# EAGLE design lol (EAGLE 5.10)
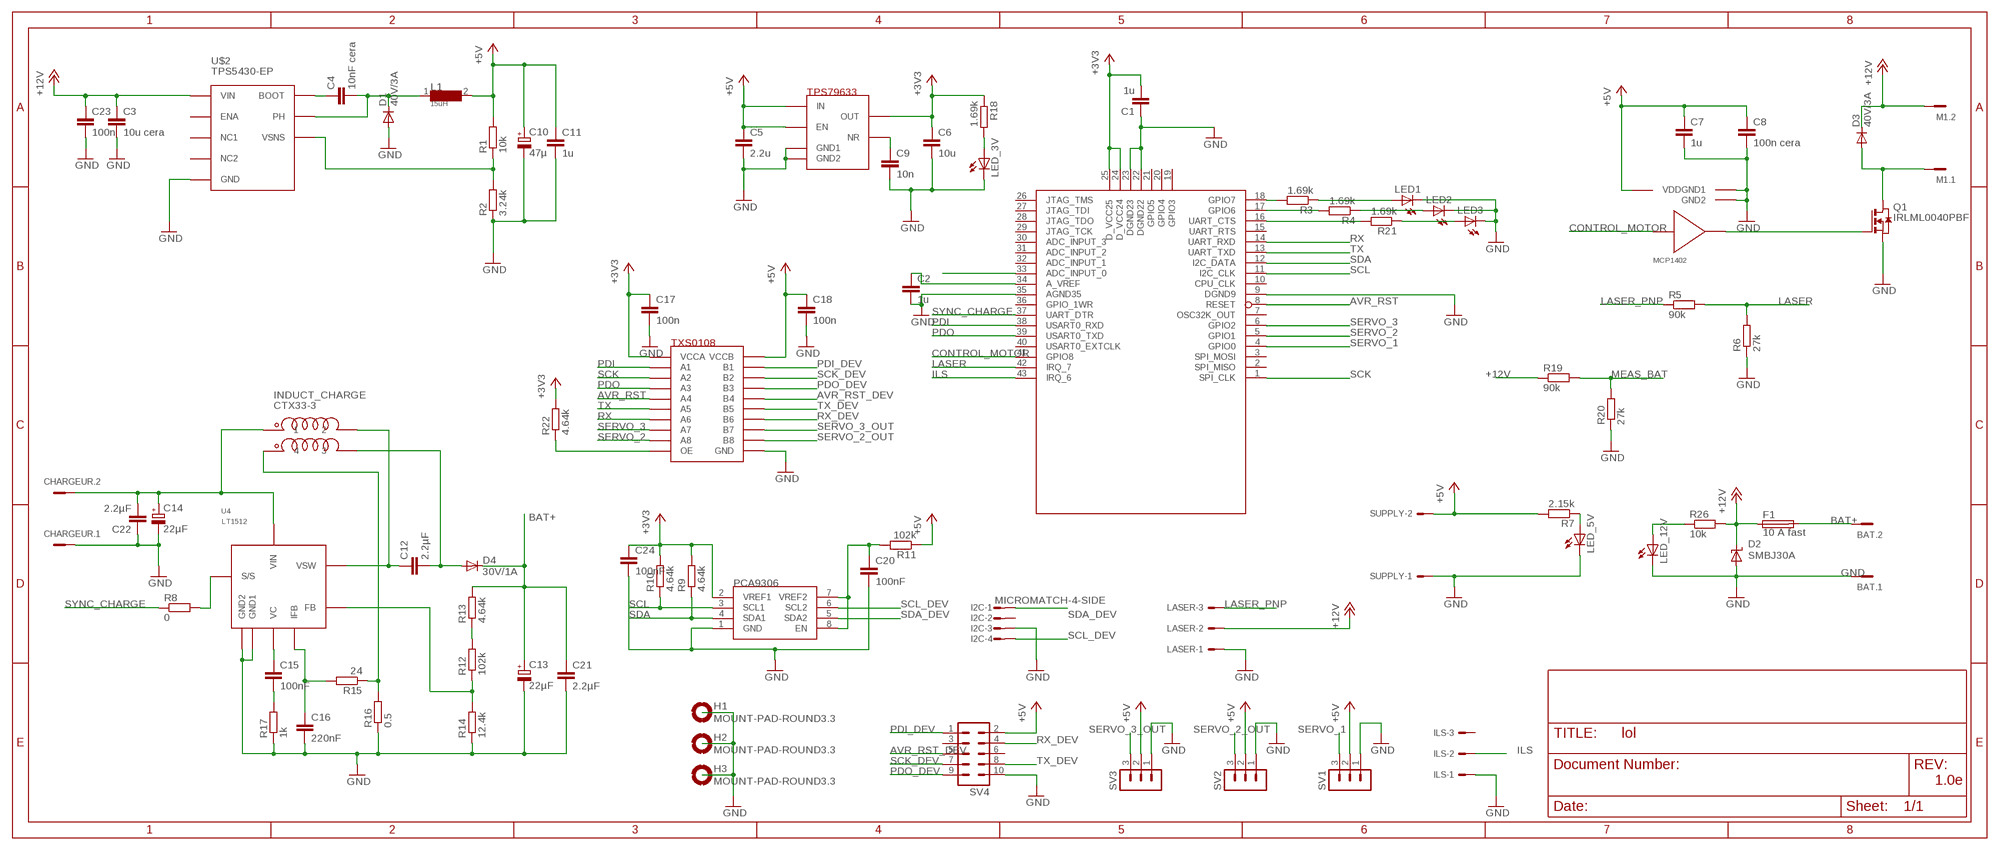
[diagram p0: schematic, sheet 1]

## Parts
BAT  MC2  [MC2]
C1  1u  C-EUC0805  [C0805]
C2  1u  C-EUC0805  [C0805]
C3  10u cera  C-EUC1210  [C1210]
C4  10nF cera  C-EUC0603  [C0603]
C5  2.2u  C-EUC0805  [C0805]
C6  10u  C-EUC1210  [C1210]
C7  1u  C-EUC0603  [C0603]
C8  100n cera  C-EUC0603  [C0603]
C9  10n  C-EUC0603  [C0603]
C10  47µ  CPOL-EUC  [PANASONIC_C]
C11  1u  C-EUC0603  [C0603]
C12  2.2µF  C-EUC0805  [C0805]
C13  22µF  CPOL-EUD/7343-31R  [D/7343-31R]
C14  22µF  CPOL-EUD/7343-31R  [D/7343-31R]
C15  100nF  C-EUC0603  [C0603]
C16  220nF  C-EUC0603  [C0603]
C17  100n  C-EUC0603  [C0603]
C18  100n  C-EUC0603  [C0603]
C20  100nF  C-EUC0805  [C0805]
C21  2.2µF  C-EUC0805  [C0805]
C22  2.2µF  C-EUC0805  [C0805]
C23  100n  C-EUC1206  [C1206]
C24  100nF  C-EUC0805  [C0805]
CHARGEUR  MC2  [MC2]
D1  40V/3A  DIODE-SMB  [SMB]
D2  SMBJ30A  SUPPRESSOR-SMBJ  [SMBJ]
D3  40V/3A  DIODE-SMB  [SMB]
D4  30V/1A  DIODE-SMB  [SMB]
F1  10 A fast  FUSE0448  [0448]
H1  MOUNT-PAD-ROUND3.3  [3,3-PAD]
H2  MOUNT-PAD-ROUND3.3  [3,3-PAD]
H3  MOUNT-PAD-ROUND3.3  [3,3-PAD]
I2C  MICROMATCH-4-SIDE  [MICROMATCH-4-SIDE]
ILS  ED1X03  [ED1X03]
INDUCT_CHARGE  CTX33-3  [CTX33-3]
L1  15uH  INDUCTANCE1  [INDUCTANCE]
LASER  ED1X03  [ED1X03]
LED1  LEDSMT1206  [1206]
LED2  LEDSMT1206  [1206]
LED3  LEDSMT1206  [1206]
LED_3V  LEDSMT1206  [1206]
LED_5V  LEDSMT1206  [1206]
LED_12V  LEDSMT1206  [1206]
M1  MC2  [MC2]
Q1  IRLML0040PBF  [SOT23]
R1  10k  R-EU_R0603  [R0603]
R2  3.24k  R-EU_R0603  [R0603]
R3  1.69k  R-EU_R0603  [R0603]
R4  1.69k  R-EU_R0603  [R0603]
R5  90k  R-EU_R0603  [R0603]
R6  27k  R-EU_M0805  [M0805]
R7  2.15k  R-EU_R0603  [R0603]
R8  0  R-EU_R0603  [R0603]
R9  4.64k  R-EU_R0603  [R0603]
R10  4.64k  R-EU_R0603  [R0603]
R11  102k  R-EU_R0603  [R0603]
R12  102k  R-EU_R0603  [R0603]
R13  4.64k  R-EU_R0603  [R0603]
R14  12.4k  R-EU_R0603  [R0603]
R15  24  R-EU_R0603  [R0603]
R16  0.5  R-EU_R0603  [R0603]
R17  1k  R-EU_R0603  [R0603]
R18  1.69k  R-EU_R0603  [R0603]
R19  90k  R-EU_R0603  [R0603]
R20  27k  R-EU_M0805  [M0805]
R21  1.69k  R-EU_R0603  [R0603]
R22  4.64k  R-EU_R0603  [R0603]
R26  10k  R-EU_R0603  [R0603]
SUPPLY  EC1X02  [EC1X02]
SV1  MA03-1  [MA03-1]
SV2  MA03-1  [MA03-1]
SV3  MA03-1  [MA03-1]
SV4  ML10  [ML10]
U2  TPS79633  [SOT223-5]
U3  TXS0108  [TSSOP20]
U4  LT1512  [LT1512]
U5  ATZB-24-A2  [ATZB-24-A2R]
U6  MCP1402  [SOT23-5]
U$1  PCA9306  [SSOP08]
U$2  TPS5430-EP  [TPS5430-EP]

## Nets
12V_NESTOR: C14.+ C22.2 CHARGEUR.2 INDUCT_CHARGE.P$1 U4.P$5(VIN)
+3V3: C1.2 C6.1 C17.1 C24.1 R9.2 R10.2 R18.1 R22.2 U2.4(OUT) U3.2(VCCA) U5.24(D_VCC24) U5.25(D_VCC25) U$1.2(VREF1)
+5V: C5.1 C7.1 C8.1 C10.+ C11.1 C18.1 L1.2 R1.2 R7.2 R11.1 SUPPLY.2 SV1.2 SV2.2 SV3.2 SV4.2 U2.1(EN) U2.2(IN) U3.19(VCCB) U6.2(VDD)
+12V: C3.1 C23.1 D2.C D3.C F1.P$1 LASER.2 M1.2 R19.1 R26.2 U$2.P$7(VIN)
AVR_RST: U3.5(A4) U5.8(RESET)
AVR_RST_DEV: SV4.5 U3.16(B4)
BAT+: BAT.2 C13.+ C21.1 D4.C F1.P$2 R13.2
CONTROL_MOTOR: U5.41(GPIO8) U6.3(IN)
GND [supply]: BAT.1 C1.1 C2.2 C3.2 C5.2 C6.2 C7.2 C8.2 C9.2 C10.- C11.2 C13.- C14.- C16.2 C17.2 C18.2 C20.2 C21.2 C22.1 C23.2 C24.2 CHARGEUR.1 D1.A D2.A H1.B3,3(MOUNT) H2.B3,3(MOUNT) H3.B3,3(MOUNT) I2C.3 ILS.1 LASER.1 LED1.C LED2.C LED3.C LED_3V.C LED_5V.C LED_12V.C Q1.2(S) R2.1 R6.1 R14.1 R16.1 R17.1 R20.1 SUPPLY.1 SV1.1 SV2.1 SV3.1 SV4.10 U2.3(GND1) U2.6(GND2) U3.11(GND) U4.P$6(GND2) U4.P$7(GND1) U5.9(DGND9) U5.22(DGND22) U5.23(DGND23) U5.35(AGND35) U6.1(GND1) U6.4(GND2) U$1.1(GND) U$2.P$6(GND)
ILS: ILS.2 U5.43(IRQ_6)
LASER: R5.2 R6.2 U5.42(IRQ_7)
LASER_PNP: LASER.3 R5.1
MEAS_BAT: R19.2 R20.2 U5.33(ADC_INPUT_0)
N$1: C9.1 U2.5(NR)
N$2: R3.2 U5.18(GPIO7)
N$3: C4.1 U$2.P$1(BOOT)
N$4: C4.2 D1.C L1.1 U$2.P$8(PH)
N$5: R1.1 R2.2 U$2.P$4(VSNS)
N$6: LED1.A R3.1
N$7: D3.A M1.1 Q1.3(D)
N$8: Q1.1(G) U6.5(OUT)
N$9: LED2.A R4.1
N$10: R4.2 U5.17(GPIO6)
N$11: R12.2 R13.1
N$12: C12.1 INDUCT_CHARGE.P$2 U4.P$8(VSW)
N$13: C15.2 R17.2
N$14: C12.2 D4.A INDUCT_CHARGE.P$3
N$15: INDUCT_CHARGE.P$4 R15.1 R16.2
N$16: R8.2 U4.P$4(S/S)
N$17: C20.1 R11.2 U$1.7(VREF2) U$1.8(EN)
N$18: C15.1 U4.P$1(VC)
N$20: LED_3V.A R18.2
N$21: C2.1 U5.34(A_VREF)
N$22: C16.1 R15.2 U4.P$3(IFB)
N$23: R21.2 U5.16(UART_CTS)
N$24: LED3.A R21.1
N$25: R22.1 U3.10(OE)
N$26: R12.1 R14.2 U4.P$2(FB)
NHLED: LED_12V.A R26.1
NPWLED: LED_5V.A R7.1
PDI: U3.1(A1) U5.38(USART0_RXD)
PDI_DEV: SV4.1 U3.20(B1)
PDO: U3.4(A3) U5.39(USART0_TXD)
PDO_DEV: SV4.9 U3.17(B3)
RX: U3.7(A6) U5.14(UART_RXD)
RX_DEV: SV4.4 U3.14(B6)
SCK: U3.3(A2) U5.1(SPI_CLK)
SCK_DEV: SV4.7 U3.18(B2)
SCL: R10.1 U5.11(I2C_CLK) U$1.3(SCL1)
SCL_DEV: I2C.4 U$1.6(SCL2)
SDA: R9.1 U5.12(I2C_DATA) U$1.4(SDA1)
SDA_DEV: I2C.1 U$1.5(SDA2)
SERVO_1: SV1.3 U5.4(GPIO0)
SERVO_2: U3.9(A8) U5.5(GPIO1)
SERVO_2_OUT: SV2.3 U3.12(B8)
SERVO_3: U3.8(A7) U5.6(GPIO2)
SERVO_3_OUT: SV3.3 U3.13(B7)
SYNC_CHARGE: R8.1 U5.37(UART_DTR)
TX: U3.6(A5) U5.13(UART_TXD)
TX_DEV: SV4.8 U3.15(B5)
Unconnected: I2C.2 ILS.3 SV4.3 SV4.6 U5.2(SPI_MISO) U5.3(SPI_MOSI) U5.7(OSC32K_OUT) U5.10(CPU_CLK) U5.15(UART_RTS) U5.19(GPIO3) U5.20(GPIO4) U5.21(GPIO5) U5.26(JTAG_TMS) U5.27(JTAG_TDI) U5.28(JTAG_TDO) U5.29(JTAG_TCK) U5.30(ADC_INPUT_3) U5.31(ADC_INPUT_2) U5.32(ADC_INPUT_1) U5.36(GPIO_1WR) U5.40(USART0_EXTCLK) U$2.P$2(NC1) U$2.P$3(NC2) U$2.P$5(ENA)

## Notes on the sheet
- IRLML0040PBF
- 1.0e

## Library data of the parts
BAT CHARGEUR M1 = con-phoenix-381_l:MC2: Mini-Combicon 3.81mm horizontal 2-polig MC 1,5/2-G-3,81 Artikel-Nr. 1803277
C1-C9 C11 C12 C15-C18 C20-C24 = rcl:C-EU: CAPACITOR, European symbol
C10 C13 C14 = rcl:CPOL-EU: POLARIZED CAPACITOR, European symbol
D1 D3 D4 = diode:DIODE-: DIODE
D2 = diode:SUPPRESSOR-: Suppressor diode
F1 = apbteam_fuse:FUSE: FUSE
H1-H3 = holes:MOUNT-PAD-ROUND: MOUNTING PAD, round
I2C = apbteam_con-amp-micromatch:MICROMATCH-4: MicroMaTch 4
ILS LASER = apbteam_con-amp-he14:E?1X03: Male header simple row, 3 positions
INDUCT_CHARGE = apbTeam:CTX33-3
L1 = zigbit:INDUCTANCE1: 12x12 mm
LED1-LED3 LED_3V LED_5V LED_12V = led:LED: LED OSRAM: - CHIPLED LG R971, LG N971, LY N971, LG Q971, LY Q971, LO R971, LY R971 LH N974, LH R974 LS Q976, LO Q976, LY Q976 LO Q996 - Hyper CHIPLED LW Q18S LB Q993, LB Q99A, LB R99A - SideLED LS A670, LO A670, LY A670, LG A670, LP A670 LB A673, LV A673, LT A673, LW A673 LH A674 LY A675 LS A676, LA A676, LO A676, LY A676, LW A676 LS A679, LY A679, LG A679 - Hyper Micro SIDELED® LS Y876, LA Y876, LO Y876, LY Y876 LT Y87S - SmartLED LW L88C, LW L88S LB L89C, LB L89S, LG L890 LS L89K, LO L89K, LY L89K LS L896, LA L896, LO L896, LY L896 - TOPLED LS T670, LO T670, LY T670, LG T670, LP T670 LSG T670, LSP T670, LSY T670, LOP T670, LYG T670 LG T671, LOG T671, LSG T671 LB T673, LV T673, LT T673, LW T673 LH T674 LS T676, LA T676, LO T676, LY T676, LB T676, LH T676, LSB T676, LW T676 LB T67C, LV T67C, LT T67C, LS T67K, LO T67K, LY T67K, LW E67C LS E67B, LA E67B, LO E67B, LY E67B, LB E67C, LV E67C, LT E67C LW T67C LS T679, LY T679, LG T679 LS T770, LO T770, LY T770, LG T770, LP T770 LB T773, LV T773, LT T773, LW T773 LH T774 LS E675, LA E675, LY E675, LS T675 LS T776, LA T776, LO T776, LY T776, LB T776 LHGB T686 LT T68C, LB T68C - Hyper Mini TOPLED® LB M676 - Mini TOPLED Santana® LG M470 LS M47K, LO M47K, LY M47K Source: http://www.osram.convergy.de - LUMILED® LXK2-PW12-R00, LXK2-PW12-S00, LXK2-PW14-U00, LXK2-PW14-V00 LXK2-PM12-R00, LXK2-PM12-S00, LXK2-PM14-U00 LXK2-PE12-Q00, LXK2-PE12-R00, LXK2-PE12-S00, LXK2-PE14-T00, LXK2-PE14-U00 LXK2-PB12-K00, LXK2-PB12-L00, LXK2-PB12-M00, LXK2-PB14-N00, LXK2-PB14-P00, LXK2-PB14-Q00 LXK2-PR12-L00, LXK2-PR12-M00, LXK2-PR14-Q00, LXK2-PR14-R00 LXK2-PD12-Q00, LXK2-PD12-R00, LXK2-PD12-S00 LXK2-PH12-R00, LXK2-PH12-S00 LXK2-PL12-P00, LXK2-PL12-Q00, LXK2-PL12-R00 Source: www.luxeon.com
Q1 = zigbit:IRLML0040PBF: MOS FET
R1-R22 R26 = rcl:R-EU_: RESISTOR, European symbol
SUPPLY = apbteam_con-amp-he14:E?1X02: Male header simple row, 2 positions
SV1-SV3 = con-lstb:MA03-1: PIN HEADER
SV4 = con-harting-ml:ML10: HARTING
U2 = zigbit:TPS79633
U3 = zigbit:TXS0108
U4 = apbTeam:LT1512
U5 = zigbit:ATZB-24-A2
U6 = zigbit:MCP1402
U$1 = zigbit:PCA9306
U$2 = apbTeam:TPS5430-EP

## Net classes
1 supply: width 0.254 mm

## Board
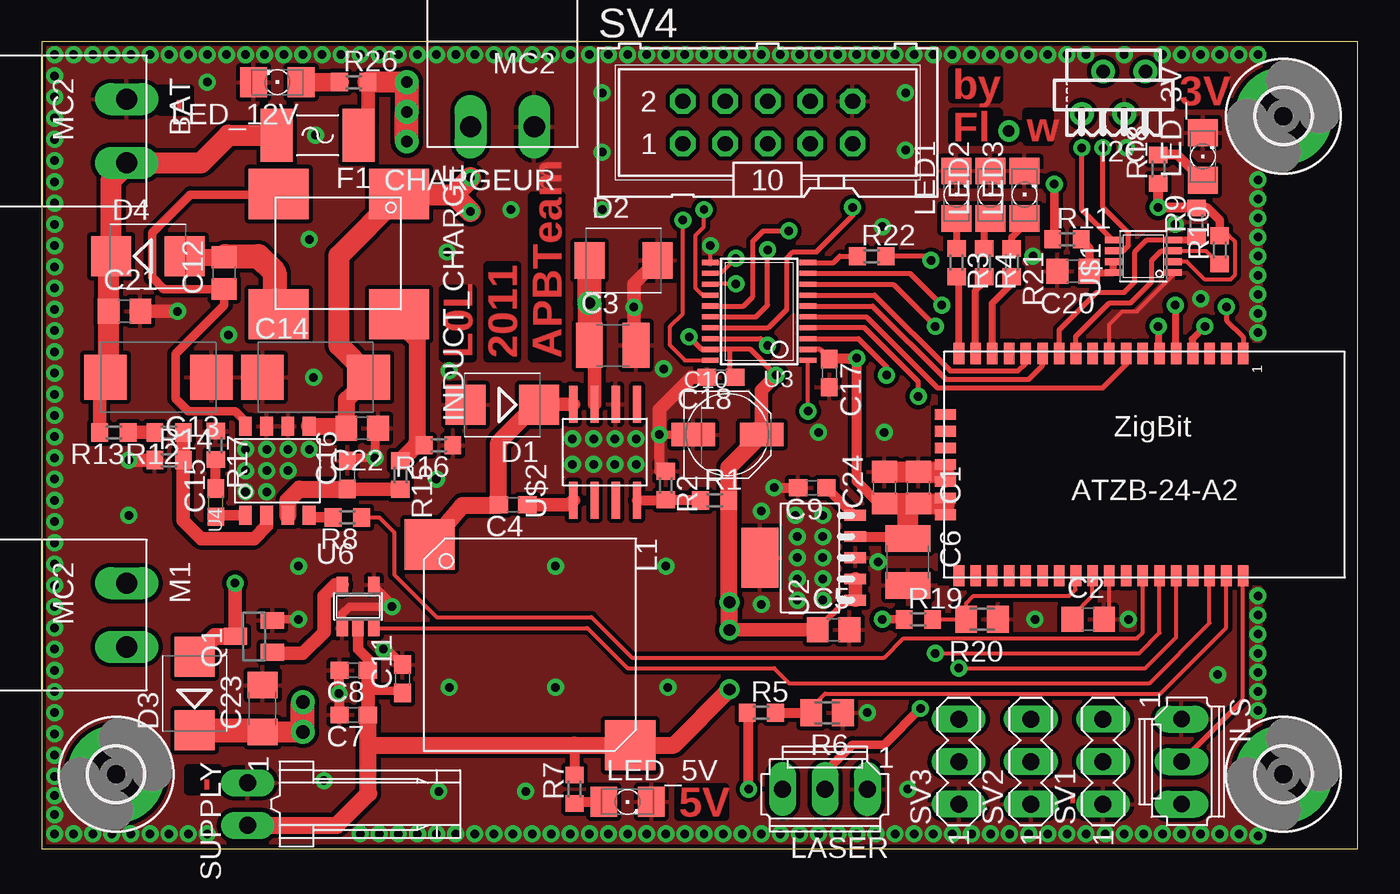
[diagram p1: board, top side]
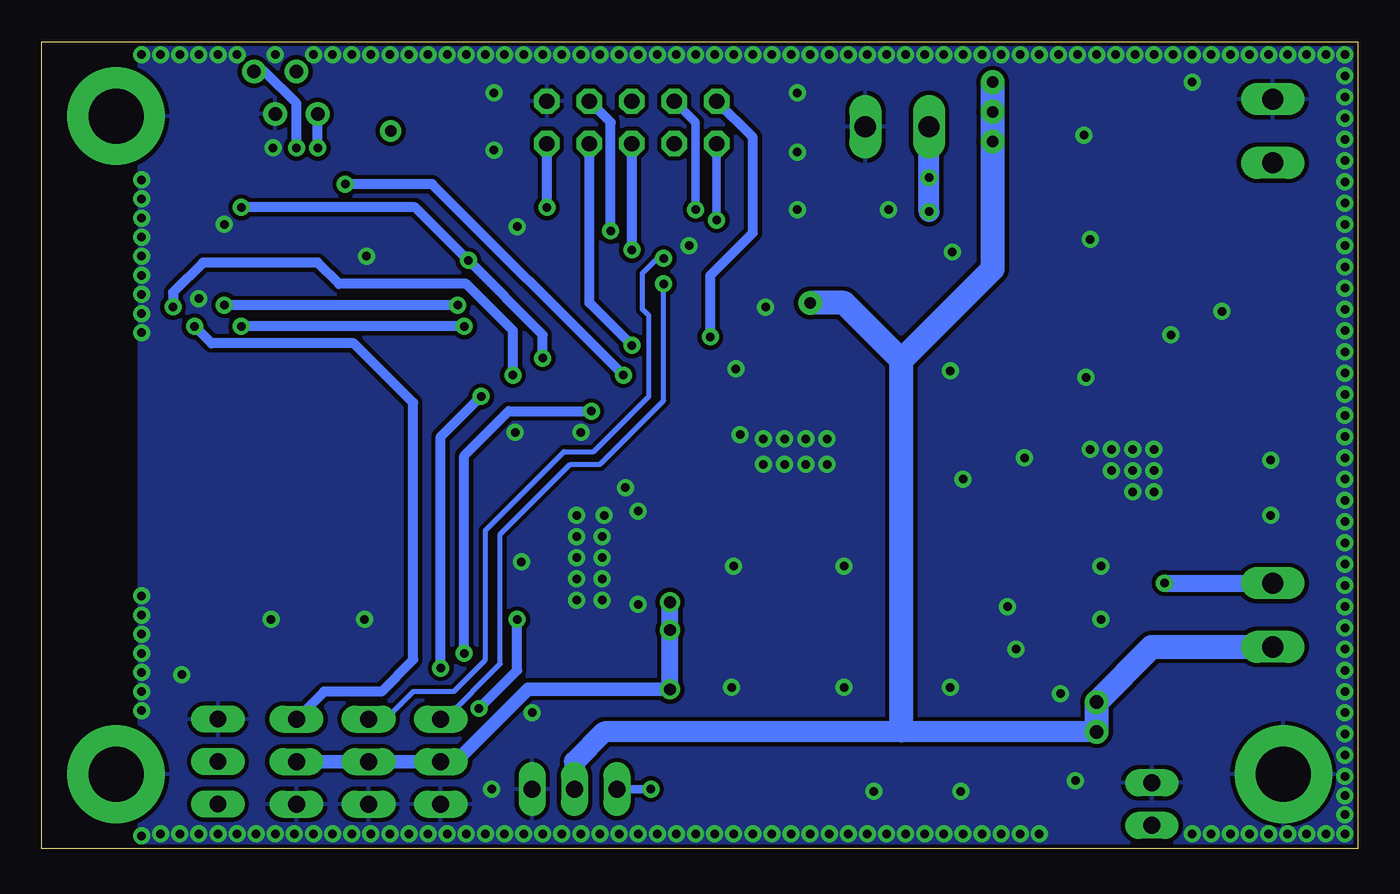
[diagram p2: board, bottom side, seen from below]

Size 78.74 x 48.26 mm. Coordinates in mm from the lower left corner, seen from the top.
Outline: 0,0 78.74,0 78.74,48.26 0,48.26 0,0
Copper layers (1*16): Top 0.035mm / dielectric 1.5mm / Bottom 0.035mm
Design rules "SparkFun": minimum track width 8mil, minimum drill 20mil, track to track 8mil, track to pad 8mil, pad to pad 8mil, via to via 8mil, smd to smd 8mil, copper to edge 10mil, drill to drill 8mil, minimum pad ring 12mil, minimum via ring 10mil, stop-mask expansion 4mil, vias tented up to drill 25mil, thermal gap 10mil

### Footprints (pad centres in the part's own frame; a part is rotated, then mirrored left to right if it is on the bottom)
MC2 = drill 1.27 long: 1 -1.905,0; 2 1.905,0
C0805 = smd 1.3 x 1.5: 1 -0.95,0; 2 0.95,0
C1210 = smd 1.6 x 2.7: 1 -1.4,0; 2 1.4,0
C0603 = smd 1.1 x 1: 1 -0.85,0; 2 0.85,0
PANASONIC_C = smd 2.6 x 1.4: + 2.05,0; - -2.05,0
D/7343-31R = smd 2.55 x 2.7: + 3.175,0; - -3.175,0
C1206 = smd 1.6 x 1.8: 1 -1.4,0; 2 1.4,0
SMB = smd 2.4 x 2.4: A 2.2,0; C -2.2,0
SMBJ = smd 1.78 x 2.16: A 2.04,0; C -2.03,0
0448 = smd 1.9 x 3.15: P$1 -2.45,0; P$2 2.45,0
3,3-PAD = drill 3.3 pad 5.842 round: B3,3 0,0
MICROMATCH-4-SIDE = drill 0.813 round: 1 1.905,1.27; 2 0.635,-1.27; 3 -0.635,1.27; 4 -1.905,-1.27
ED1X03 = drill 1 long: 1 -2.54,0; 2 0,0; 3 2.54,0
CTX33-3 = smd 3 x 3.6: P$1 -3.6,3.6; P$2 -3.6,-3.6; P$3 3.6,-3.6; P$4 3.6,3.6
INDUCTANCE = smd 3 x 3: 1 -6,-6; 2 6,6
1206 = smd 1.6 x 1.803: A -1.422,0; C 1.422,0
SOT23 = smd 1 x 1.4: 1 -0.95,-1.1; 2 0.95,-1.1; 3 0,1.1
R0603 = smd 1 x 1.1: 1 -0.85,0; 2 0.85,0
M0805 = smd 1.3 x 1.6: 1 -0.95,0; 2 0.95,0
EC1X02 = drill 1 long: 1 -1.27,0; 2 1.27,0
MA03-1 = drill 1.016 long: 1 -2.54,0; 2 0,0; 3 2.54,0
ML10 = drill 0.914 octagon: 1 -5.08,-1.27; 2 -5.08,1.27; 3 -2.54,-1.27; 4 -2.54,1.27; 5 0,-1.27; 6 0,1.27; 7 2.54,-1.27; 8 2.54,1.27; 9 5.08,-1.27; 10 5.08,1.27
SOT223-5 = smd 0.635 x 1.27: 1 -2.54,-2.7; 2 -1.27,-2.7; 3 0,-2.7; 4 1.27,-2.7; 5 2.54,-2.7 | smd 3.6 x 2.2: 6 0,3
TSSOP20 = smd 0.305 x 0.991: 1 -2.925,-2.918; 2 -2.275,-2.918; 3 -1.625,-2.918; 4 -0.975,-2.918; 5 -0.325,-2.918; 6 0.325,-2.918; 7 0.975,-2.918; 8 1.625,-2.918; 9 2.275,-2.918; 10 2.925,-2.918; 11 2.925,2.918; 12 2.275,2.918; 13 1.625,2.918; 14 0.975,2.918; 15 0.325,2.918; 16 -0.325,2.918; 17 -0.975,2.918; 18 -1.625,2.918; 19 -2.275,2.918; 20 -2.925,2.918
LT1512 = smd 1.143 x 0.762: P$1 -2.794,1.778; P$2 -2.794,0.508; P$3 -2.794,-0.762; P$4 -2.794,-2.032; P$5 2.54,-2.032; P$6 2.54,-0.762; P$7 2.54,0.508; P$8 2.54,1.778
ATZB-24-A2R = smd 0.635 x 1.27: 1 17.9,-0.1; 2 16.9,-0.1; 3 15.9,-0.1; 4 14.9,-0.1; 5 13.9,-0.1; 6 12.9,-0.1; 7 11.9,-0.1; 8 10.9,-0.1; 9 9.9,-0.1; 10 8.9,-0.1; 11 7.9,-0.1; 12 6.9,-0.1; 13 5.9,-0.1; 14 4.9,-0.1; 15 3.9,-0.1; 16 2.9,-0.1; 17 1.9,-0.1; 18 0.9,-0.1; 26 0.9,-13.4; 27 1.9,-13.4; 28 2.9,-13.4; 29 3.9,-13.4; 30 4.9,-13.4; 31 5.9,-13.4; 32 6.9,-13.4; 33 7.9,-13.4; 34 8.9,-13.4; 35 9.9,-13.4; 36 10.9,-13.4; 37 11.9,-13.4; 38 12.9,-13.4; 39 13.9,-13.4; 40 14.9,-13.4; 41 15.9,-13.4; 42 16.9,-13.4; 43 17.9,-13.4 | smd 1.27 x 0.635: 19 0.1,-3.75; 20 0.1,-4.75; 21 0.1,-5.75; 22 0.1,-6.75; 23 0.1,-7.75; 24 0.1,-8.75; 25 0.1,-9.75
SOT23-5 = smd 0.69 x 0.99: 1 -0.95,-1.29; 2 0,-1.29; 3 0.95,-1.29; 4 0.95,1.3; 5 -0.95,1.3
SSOP08 = smd 0.4 x 1: 1 -0.975,-1.8; 2 -0.325,-1.8; 3 0.325,-1.8; 4 0.975,-1.8; 5 0.975,1.8; 6 0.325,1.8; 7 -0.325,1.8; 8 -0.975,1.8
TPS5430-EP = smd 2.2 x 0.5: P$1 -0.88,4.39; P$2 -0.88,3.12; P$3 -0.88,1.85; P$4 -0.88,0.58; P$5 4.87,0.58; P$6 4.87,1.85; P$7 4.87,3.12; P$8 4.87,4.39

### Placement (x,y rotation side)
BAT  5.08,42.93 270 top
C1  52.45,21.59 270 top
C2  62.61,13.72 0 top
C3  34.16,30.1 0 top
C4  28.19,20.57 180 top
C5  47.37,13.08 0 top
C6  51.82,17.14 270 top
C7  18.67,8 180 top
C8  18.67,10.67 180 top
C9  46.1,21.59 180 top
C10  41.02,24.77 0 top
C11  21.59,10.16 90 top
C12  10.92,34.42 90 top
C13  6.99,28.19 180 top
C14  16.38,28.19 0 top
C15  10.41,20.7 90 top
C16  18.29,22.35 90 top
C17  47.12,28.45 270 top
C18  40.64,28.19 180 top
C20  61.72,34.54 180 top
C21  4.95,32.13 0 top
C22  19.18,25.15 180 top
C23  13.21,8.38 90 top
C24  50.42,21.59 90 top
CHARGEUR  27.56,43.18 180 top
D1  27.56,26.54 180 top
D2  34.8,35.18 0 top
D3  9.14,9.27 90 top
D4  6.35,35.43 0 top
F1  16.51,42.67 180 top
H1  74.3,43.81 0 top
H2  4.45,4.45 0 top
H3  74.3,4.45 0 top
I2C  64.14,45.21 180 top
ILS  68.2,5.21 270 top
INDUCT_CHARGE  17.78,35.56 270 top
L1  29.21,12.19 270 top
LASER  46.86,3.56 180 top
LED1  54.74,39.12 90 top
LED2  56.77,39.12 90 top
LED3  58.8,39.12 90 top
LED_3V  69.47,41.4 90 top
LED_5V  35.05,2.79 0 top
LED_12V  14.1,45.85 180 top
M1  5.08,13.97 270 top
Q1  12.7,12.7 90 top
R1  40.26,20.83 0 top
R2  37.34,21.72 270 top
R3  54.74,35.05 270 top
R4  56.39,35.05 270 top
R5  43.05,8.13 0 top
R6  46.99,8.13 180 top
R7  31.88,3.56 90 top
R8  18.29,19.81 180 top
R9  69.09,37.47 90 top
R10  70.48,35.81 90 top
R11  61.34,36.45 0 top
R12  7.62,24.89 180 top
R13  4.32,24.89 180 top
R14  7.62,23.24 0 top
R15  21.46,22.35 270 top
R16  23.75,24.13 180 top
R17  10.41,24.13 270 top
R18  66.8,40.64 90 top
R19  52.45,13.72 0 top
R20  56.26,13.72 180 top
R21  58.04,35.05 270 top
R22  49.66,35.43 0 top
R26  18.67,45.85 0 top
SUPPLY  12.32,2.67 270 top
SV1  63.5,5.21 90 top
SV2  59.18,5.21 90 top
SV3  54.86,5.21 90 top
SV4  43.43,43.43 0 top
U2  45.97,17.4 90 top
U3  42.93,32.13 90 top
U4  13.97,22.73 90 top
U5  53.98,29.72 0 top
U6  18.92,14.48 0 top
U$1  65.91,35.43 90 top
U$2  36.2,21.72 90 top

### Tracks (layer width: path | path; a pad name or v marks a point on that pad's centre or on a via)
12V_NESTOR  (via drill 0.51 pad 0.51)
  Top 0.61: U4.P$5 16.13,25.15
  Top 1.016: 21.42,39.12 INDUCT_CHARGE.P$1 | C14.+ 18.23,26.86 C22.2 18.1,25.27 U4.P$5
  Top 1.27: 24.64,39.12 21.42,39.12 17.78,35.47 17.78,30.1 19.56,28.32 C14.+ | 24.64,39.12 v25.65,40.13 | 24.64,39.12 v25.65,38.1
  Top 2.159: INDUCT_CHARGE.P$1 21.13,39.16
  Bottom 1.27: v25.65,38.1 CHARGEUR.2
+3V3  (via drill 0.51 pad 0.3, 0.51 pad 0.51)
  Top 0.254: R10.2 71.03,36.66 71.37,36.32 71.37,34.29 71.12,34.04 69.6,34.04 68.52,35.11 U$1.2 | U5.24 U5.25 54.08,20.35 53.98,20.45
  Top 0.305: R10.2 70.4,36.66 | C17.1 46.56,29.86 U3.2 | v53.21,35.18 52.96,35.43 R22.2
  Top 0.406: R9.2 68.83,38.23 | C6.1 52.32,18.55 52.32,18.67
  Top 0.508: R9.2 69.13,38.35 69.72,38.35 70.48,37.59 R10.2 | C17.1 47.28,29.46
  Top 0.61: R9.2 68.8,38.35 v66.8,38.35 R18.1 | C17.1 48.3,29.3 v48.77,29.34 48.77,21.97 50.1,20.64 C24.1 | U2.4 51.31,18.67 51.43,18.55 C6.1
  Top 1.27: C1.2 C24.1 | C1.2 51.82,20.64 C6.1 | C1.2 53.98,20.64 53.98,20.45
  Bottom 0.61: v66.8,38.35 56.39,38.35 53.4,35.37 v53.21,35.18 48.77,30.73 v48.77,29.34
+5V  (via drill 0.51, 0.51 pad 0.51, 0.7 pad 0.51)
  Top 0.254: U3.19 40,29.84
  Top 0.305: 41.15,29.86 42.41,29.86 v43.94,28.32 | 41.15,29.86 U3.19 39.49,29.86 v38.73,30.61 | C18.1 41.15,28.54 41.15,29.86
  Top 0.356: 46.48,13.21 48.13,14.86
  Top 0.406: 19.52,9.4 19.56,9.44 | C5.1 46.48,13.14 46.48,13.21 | 48.13,14.86 U2.1
  Top 0.508: R11.1 60.58,36.54 v60.58,39.75 | C11.1 21.46,9.44 19.56,9.44
  Top 0.61: 31.88,6.19 R7.2 | U2.1 48.51,14.86
  Top 0.635: U6.2 18.92,11.94 19.52,11.34 C8.1
  Top 0.813: C8.1 19.52,9.4 C7.1 19.56,8 | C10.+ 43.05,25.16 43.05,27.43 v43.94,28.32 | U2.1 U2.2 | v41.15,13.08 C5.1
  Top 1.016: 42.97,25.15 C10.+ 41.11,22.8 R1.2 41.11,14.73 v41.15,14.73 v41.15,13.08 | v41.15,9.53 37.81,6.19 L1.2 31.88,6.19 19.68,6.19 19.52,6.35 | SUPPLY.2 17.64,1.4 19.56,3.31 19.52,3.35 19.52,6.35 | 19.52,6.35 C7.1
  Bottom 0.406: 49.66,9.53 49.91,9.53
  Bottom 0.61: v60.58,39.75 55.37,39.75 v43.94,28.32 | SV4.2 36.2,42.55 36.2,36.83 38.73,34.29 v38.73,30.61
  Bottom 0.813: v41.15,9.53 49.66,9.53 53.98,5.21 SV3.2 SV2.2 SV1.2
  Bottom 1.016: v41.15,9.53 v41.15,13.08 v41.15,14.73
+12V  (via drill 0.51 pad 0.51, 0.7 pad 1.42, 0.8 pad 1.42)
  Top 0.406: 18.92,42.93 18.96,42.93 F1.P$1
  Top 0.508: C3.1 32.95,29.66 | LASER.2 46.86,4.57 48.51,6.22 50.42,6.22 v52.58,8.38 | v50.29,13.72 R19.1
  Top 0.813: U$2.P$7 33.08,29.79 C3.1 | 18.96,42.93 19.52,43.48 R26.2
  Top 1.27: C23.1 v15.62,6.99 | v21.84,45.85 R26.2
  Top 1.422: D2.C v32.77,32.64 C3.1 | v21.84,45.85 v21.84,44.07 v21.84,42.29 | D3.C 13.12,7.07 C23.1 | v15.62,6.99 v15.62,8.76
  Bottom 0.61: v50.29,13.72 50.29,10.67 v52.58,8.38
  Bottom 1.016: 27.3,6.99 27.3,7.62
  Bottom 1.27: v15.62,6.99 27.3,6.99 45.09,6.99 46.86,5.21 LASER.2
  Bottom 1.422: v21.84,45.85 v21.84,42.29 21.84,34.67 27.3,29.21 | 27.3,29.21 30.73,32.64 v32.77,32.64 | 27.3,7.62 27.3,29.21 | M1.2 12.32,12.06 v15.62,8.76 v15.62,6.99
AVR_RST
  Top 0.254: U5.8 64.88,29.44
  Top 0.305: U5.8 64.88,28.93 63.5,27.56 53.59,27.56 49.35,31.81 U3.5
AVR_RST_DEV  (via drill 0.51 pad 0.51)
  Top 0.305: v43.43,35.81 43.43,32.51 42.73,31.81 U3.16
  Bottom 0.61: v43.43,35.81 SV4.5
BAT+
  Top 0.813: C13.+ 3.47,27.85 R13.2
  Top 1.27: C13.+ 4,28.39 C21.1 4,35.29 D4.C 4.15,39.96 5.08,40.89 BAT.2 9.53,41.02 11.18,42.67 F1.P$2
CONTROL_MOTOR
  Top 0.254: U6.3 32.62,13.19 32.64,13.21 35.05,10.79 43.81,10.79 44.7,9.91 66.29,9.91 69.88,13.49 U5.41
GND  (via drill 0.51 pad 0.51)
  Top 0.254: U3.11 v40.01,36.06 v40.01,36.07 | C7.2 17.78,8 | 63.88,29.87 U5.9 63.88,31.36 64.64,32.13 65.53,32.13 67.71,34.31 U$1.1 | 18.41,23.24 18.63,23.24 | 54.1,22.23 54.08,22.23 U5.23 | 63.88,14.03 U5.35 | U5.22 53.76,22.65 53.76,22.54
  Top 0.305: C2.2 63.88,14.03
  Top 0.406: Q1.2 13.48,13.72 | C7.2 17.78,8.04 17.78,8.51 17.82,8.55 | 17.97,10.82 C8.2 17.78,10.63 | 17.82,9.23 v17.78,9.27 | U6.1 18.03,13.25 | 19.87,15.68 U6.4 | 19.94,25.09 20.07,25.09 C22.1 | 18.67,23.37 C16.2 | 10.29,25.11 10.41,25.23 | U5.9 63.88,29.88 | C1.1 52.32,22.23
  Top 0.508: 19.94,25.09 v19.94,23.37 18.67,23.37 | v36.96,24.77 C10.- | 13.48,13.72 v15.37,13.72 | C3.2 35.44,29.97 | C11.2 20.66,11.94 v20.45,11.94 | U6.1 17.97,14.04 18.41,14.48 v20.95,14.48 20.95,14.6 19.87,15.68
  Top 0.61: v17.78,9.27 17.78,10.63 | 17.82,8.55 17.82,9.23 | R17.1 10.29,25.11 | R6.1 48.13,8.13 | v43.81,21.59 45.09,21.59 | R2.1 36.96,22.57 v36.96,24.77
  Top 0.813: v36.96,24.77 36.96,26.29 38.86,28.19 C18.2 | v5.21,23.24 6.73,23.24 | 5.71,32.13 v8.13,32.13 | D2.A 35.43,33.77 v35.43,32.38 35.43,30.23 C3.2 | C3.2 | C3.2 35.56,29.84
  Top 1.27: C24.2 C1.1 53.76,22.54 54.08,22.23
  other vias: 37.34,47.5 38.48,47.5 39.62,47.5 40.77,47.5 41.91,47.5 43.05,47.5 44.2,47.5 45.34,47.5 46.48,47.5 47.62,47.5 48.77,47.5 49.91,47.5 51.05,47.5 52.2,47.5 53.34,47.5 54.48,47.5 55.63,47.5 56.77,47.5 57.91,47.5 59.05,47.5 60.2,47.5 61.34,47.5 67.06,47.5 68.2,47.5 69.34,47.5 70.48,47.5 71.63,47.5 0.76,0.89 1.91,0.89 3.05,0.89 4.19,0.89 5.33,0.89 6.48,0.89 7.62,0.89 8.76,0.89 9.91,0.89 19.05,0.89 20.19,0.89 21.34,0.89 22.48,0.89 23.62,0.89 24.77,0.89 25.91,0.89 27.05,0.89 28.19,0.89 29.34,0.89 30.48,0.89 31.62,0.89 32.77,0.89 33.91,0.89 35.05,0.89 36.2,0.89 37.34,0.89 38.48,0.89 39.62,0.89 40.77,0.89 41.91,0.89 43.05,0.89 44.2,0.89 45.34,0.89 46.48,0.89 47.62,0.89 48.77,0.89 49.91,0.89 51.05,0.89 52.2,0.89 53.34,0.89 54.48,0.89 55.63,0.89 56.77,0.89 57.91,0.89 59.05,0.89 60.2,0.89 61.34,0.89 62.48,0.89 63.63,0.89 65.91,0.89 67.06,0.89 68.2,0.89 69.34,0.89 70.48,0.89 71.63,0.89 28.19,47.5 29.34,47.5 30.48,47.5 31.62,47.5 32.77,47.5 33.91,47.5 35.05,47.5 36.2,47.5 23.62,22.1 59.31,35.43 46.74,17.4 49.4,8.13 9.91,45.85 46.48,24.89 12.19,21.34 12.19,22.61 12.19,23.88 13.46,23.88 13.46,22.61 13.46,21.34 14.73,23.88 14.73,22.61 16,23.88 46.74,16.13 46.74,14.86 45.21,14.86 45.21,16.13 45.21,17.4 45.21,18.67 31.75,24.51 31.75,22.99 33.02,22.99 34.29,22.99 35.56,22.99 35.56,24.51 34.29,24.51 33.02,24.51 46.74,18.67 46.74,19.94 45.09,19.94 50.42,24.89 24.38,28.57 0.76,47.5 1.91,47.5 3.05,47.5 4.19,47.5 5.33,47.5 6.48,47.5 7.62,47.5 8.76,47.5 9.91,47.5 11.05,47.5 12.19,47.5 13.34,47.5 14.48,47.5 15.62,47.5 16.76,47.5 17.91,47.5 19.05,47.5 20.19,47.5 21.34,47.5 22.48,47.5 23.62,47.5 24.77,47.5 25.91,47.5 27.05,47.5 64.77,0.89 0.76,46.23 0.76,44.96 0.76,43.69 0.76,42.42 0.76,41.15 0.76,39.88 0.76,38.61 0.76,37.34 0.76,36.07 0.76,34.8 0.76,33.53 0.76,32.26 0.76,30.99 0.76,29.72 0.76,28.45 0.76,27.18 0.76,25.91 0.76,24.64 0.76,23.37 0.76,22.1 0.76,20.83 0.76,19.56 0.76,18.29 0.76,17.02 0.76,15.75 0.76,14.48 0.76,13.21 0.76,11.94 0.76,10.67 0.76,9.4 0.76,8.13 0.76,6.86 0.76,5.59 0.76,3.17 0.76,2.03 0.76,4.32 72.77,9.4 72.77,10.54 72.77,11.68 72.77,12.83 72.77,13.97 72.77,0.76 72.77,8.26 72.77,47.5 72.77,40.01 72.77,38.86 72.77,37.72 72.77,36.58 72.77,35.43 72.77,34.29 72.77,33.15 72.77,32 62.48,47.5 64.77,47.5 24.38,9.65 16,36.45 28.07,38.23 65.02,13.72 59.44,13.72 11.18,30.73 16.26,28.19 50.04,17.14 43.05,14.61 43.05,20.19 70.36,10.41 28.96,3.43 69.34,32.89 33.53,45.21 33.53,38.23 51.69,45.21 37.34,16.89 30.73,16.89 37.47,9.65 30.73,9.65 15.37,16.89 5.21,19.94 16.38,42.67 51.69,41.78 51.82,3.56 16.89,4.06 23.75,3.43 37.21,28.7 33.53,41.66 50.29,37.21 24.26,35.69 64.9,41.91 67.82,37.34 72.77,30.86 72.77,15.11
  pour Top (isolate 0.254): 0,48.26 72.9,48.26 72.9,30.35 53.47,30.35 53.47,15.62 72.9,15.62 72.9,0.13 0,0.13
  pour Bottom (isolate 0.254): 0,48.26 72.9,48.26 72.9,0.13 0,0.13
ILS
  Top 0.254: 71.88,8.88 U5.43
  Top 0.305: ILS.2 71.88,8.88
LASER
  Top 0.254: 46.04,8.32 R6.2 46.04,8.45 46.86,9.27 66.93,9.27 70.88,13.22 U5.42
  Top 0.61: R5.2 R6.2
LASER_PNP  (via drill 0.51 pad 0.51)
  Top 0.61: v42.29,3.56 42.29,8.04 R5.1
  Bottom 0.508: v42.29,3.56 LASER.3
MEAS_BAT
  Top 0.254: U5.33 61.85,16.29 61.85,15.49 61.47,15.11 55.75,15.11 55.31,14.67 R20.2 R19.2
N$1
  Top 0.61: C9.1 48.6,19.94 U2.5
N$2
  Top 0.406: 54.88,34.2 R3.2 54.88,34.06 U5.18
N$3
  Top 0.813: U$2.P$1 31.54,20.57 C4.1
N$4
  Top 0.254: 27.3,20.54 C4.2
  Top 0.813: U$2.P$8 29.8,26.59 D1.C
  Top 1.016: C4.2 27.34,24.3 29.58,26.54 D1.C | 27.3,20.54 25.17,20.54 L1.1
N$5
  Top 0.61: U$2.P$4 37.34,20.84 R2.2 39.41,20.87 R1.1
N$6
  Top 0.406: LED1.A R3.1
N$7  (via drill 0.51 pad 0.51)
  Top 0.61: 11.56,12.74 Q1.3 11.56,12.66
  Top 0.813: 11.56,12.74 v11.56,15.88
  Top 1.016: D3.A 10.37,12.7 Q1.3
  Bottom 1.016: v11.56,15.88 M1.1
N$8
  Top 0.254: 17.94,15.75 U6.5 17.97,15.31 | Q1.1 13.61,11.94 13.86,11.68
  Top 0.813: 13.86,11.68 15.62,11.68 16.89,12.95 16.89,15.11 17.56,15.78 U6.5
N$9
  Top 0.406: LED2.A 56.39,37.31 R4.1
N$10
  Top 0.406: R4.2 56.39,33.91 55.88,33.4 U5.17
  Top 0.508: U5.17 55.88,29.88
N$11
  Top 0.813: R13.1 R12.2
N$12
  Top 0.508: U4.P$8 12.19,25.53 11.56,26.16 8.76,26.16 8,26.92 8,29.59 10.92,32.51 C12.1 7.3,33.47 6.6,34.16 6.6,36.83 8.89,39.12 13.37,39.12 13.76,38.73
  Top 1.016: 13.76,38.73 INDUCT_CHARGE.P$2
N$13
  Top 0.61: C15.2 R17.2
N$14
  Top 0.406: C12.2 10.99,35.37 10.99,35.43
  Top 1.016: D4.A 8.44,35.37 C12.2
  Top 1.422: 10.99,35.43 12.95,35.43 13.93,34.46 13.93,32.21 INDUCT_CHARGE.P$3
N$15
  Top 1.016: R15.1 22.39,24.13 | 22.39,24.13 R16.2 | 22.39,24.13 22.48,24.22 22.48,30.35 21.38,31.45 INDUCT_CHARGE.P$4
N$16
  Top 0.635: U4.P$4 16.13,19.81 R8.2
N$17
  Top 0.406: 62.29,36.29 62.38,36.38 | C20.1 62.38,34.46 U$1.8 U$1.7
  Top 0.508: 62.29,36.29 62.67,35.91 C20.1
  Top 0.61: 62.38,36.38 R11.2
N$18
  Top 0.635: C15.1 10.5,19.94 U4.P$1
N$19  (via drill 0.7 pad 1.27)
  other vias: 57.86,42.93
N$20
  Top 0.406: 66.8,41.5 R18.2
  Top 0.61: 66.8,41.5 67.94,41.5 LED_3V.A
N$21
  Top 0.254: C2.1 61.66,13.91 62.88,15.12 U5.34
N$22
  Top 0.813: C16.1 R15.2
  Top 1.016: C16.1 15.41,21.5 14.73,20.83 U4.P$3
N$23
  Top 0.406: R21.2 58.04,33.78 56.88,32.62 U5.16
N$24
  Top 0.406: LED3.A 58.67,37.57 58.67,37.21 58.04,36.58 R21.1
N$25
  Top 0.305: R22.1 47.75,35.43 47.38,35.06 U3.10
N$26
  Top 0.813: R14.2 R12.1 | R14.2 8.51,23.2 | U4.P$2 13.46,19.3 12.7,18.54 9.53,18.54 8.47,19.6 R14.2
NHLED
  Top 1.092: LED_12V.A R26.1
NPWLED
  Top 0.61: LED_5V.A 31.96,2.79 R7.1
PDI  (via drill 0.51)
  Top 0.254: 66.93,16.26 U5.38 66.88,12.9 65.66,11.68 v53.47,11.68 | v45.85,26.16 v45.84,26.16 U3.1
  Bottom 0.61: v45.85,26.16 50.8,26.16 53.47,23.5 v53.47,11.68
PDI_DEV  (via drill 0.51 pad 0.51)
  Top 0.254: 39.63,29.21 39.62,29.21 | v38.35,37.59 38.35,32 37.59,31.24 37.59,30.1 38.48,29.21 U3.20
  Top 0.305: U3.20 39.63,29.21
  Bottom 0.508: v38.35,37.59 SV4.1
PDO  (via drill 0.51, 0.51 pad 0.51)
  Top 0.254: v54.86,10.79 66.04,10.79 67.88,12.63 U5.39
  Top 0.305: U3.4 49.23,31.16 52.45,27.94 v52.45,27.05
  Bottom 0.61: v52.45,27.05 54.86,24.64 v54.86,10.79
PDO_DEV  (via drill 0.51 pad 0.51)
  Top 0.305: v48.51,38.35 48.51,37.85 46.35,35.69 44.96,35.69 44.58,35.31 44.58,32.26 43.48,31.16 U3.17
  Bottom 0.61: v48.51,38.35 SV4.9
RX
  Top 0.305: U5.14 58.88,29.03 58.42,28.57 54.36,28.57 49.83,33.11 U3.7
RX_DEV  (via drill 0.51 pad 0.51)
  Top 0.254: v39.62,38.23 39.62,37.21 39.12,36.7 39.12,33.53 39.48,33.17 arc45 39.62,33.11 U3.14
  Bottom 0.508: SV4.4 39.62,43.43 v39.62,38.23
SCK  (via drill 0.51, 0.51 pad 0.51)
  Top 0.254: U3.3 45.87,30.48
  Top 0.305: v70.88,32.4 70.88,31.61 71.88,30.61 U5.1 | v50.55,28.32 50.55,28.83 48.87,30.51 U3.3
  Top 0.508: U5.1
  Top 0.61: U5.1 71.88,29.88
  Bottom 0.508: 70.87,33.27 70.88,33.26
  Bottom 0.61: 70.87,33.27 69.09,35.05 62.23,35.05 60.96,33.78 53.34,33.78 50.55,30.99 v50.55,28.32 | 70.88,33.26 v70.88,32.4
SCK_DEV  (via drill 0.51)
  Top 0.254: U3.18 39.73,30.51
  Top 0.305: v43.43,30.1 43.03,30.51 U3.18
  Bottom 0.61: SV4.7 45.97,32.64 v43.43,30.1
SCL
  Top 0.254: R10.1 70.45,34.96 69.65,35.76 U$1.3
  Top 0.305: R10.1 70.36,35.31 | U$1.3 67,35.76 66.42,35.18 66.42,33.91 65.15,32.64 63.88,32.64 61.88,30.63 U5.11
  Top 0.406: U5.11 61.85,29.9
SCL_DEV  (via drill 0.51 pad 0.51)
  Top 0.254: U$1.6 64.46,35.76
  Top 0.305: v63.5,41.91 63.5,38.35 65.02,36.83 65.02,36.07 64.71,35.76 U$1.6
  Bottom 0.61: I2C.4 65.41,46.48 63.5,44.58 v63.5,41.91
SDA
  Top 0.305: 69.01,36.41 R9.1 | U$1.4 66.13,36.41 65.41,35.69 65.41,33.91 64.77,33.27 63.12,33.27 60.88,31.03 U5.12
  Top 0.406: U5.12 60.96,29.96 | U$1.4 69.01,36.41
SDA_DEV  (via drill 0.51 pad 0.51)
  Top 0.254: U$1.5 64.05,36.41
  Top 0.305: v62.23,41.91 62.23,41.15 62.23,38.23 64.05,36.41
  Bottom 0.61: v62.23,41.91 I2C.1
SERVO_1  (via drill 0.51 pad 0.51)
  Top 0.406: U5.4 68.83,29.87 68.83,30.48 v69.6,31.24
  Bottom 0.61: v69.6,31.24 68.58,30.23 60.07,30.23 56.52,26.67 56.52,11.3 58.42,9.4 61.85,9.4 SV1.3
SERVO_2  (via drill 0.51)
  Top 0.254: 67.82,29.68 U5.5
  Top 0.305: v53.85,32.51 51.95,34.41 U3.9
  Top 0.406: v67.82,32.51 67.82,29.68
  Bottom 0.61: v53.85,32.51 v67.82,32.51
SERVO_2_OUT  (via drill 0.51)
  Top 0.254: v41.53,35.31 40.63,34.41 U3.12
  Bottom 0.254: SV2.3 58.93,7.75
  Bottom 0.305: v41.53,35.31 41.91,35.31 42.8,34.42 42.8,32.26 42.42,31.88 42.42,27.05 45.72,23.75 47.5,23.75 52.2,19.05 52.2,11.3 54.1,9.4 56.52,9.4 58.17,7.75 SV2.3
SERVO_3  (via drill 0.51)
  Top 0.254: U3.8 45.87,33.78 | 66.8,29.69 U5.6
  Top 0.305: v53.47,31.24 50.95,33.76 U3.8
  Top 0.406: v66.8,31.24 66.8,29.69
  Bottom 0.61: v53.47,31.24 v66.8,31.24
SERVO_3_OUT  (via drill 0.51)
  Top 0.254: U3.13 40.03,33.78 v41.53,33.78
  Bottom 0.305: SV3.3 54.61,7.75 51.31,11.05 51.31,18.8 47.12,22.99 45.34,22.99 41.53,26.8 v41.53,33.78
SYNC_CHARGE
  Top 0.254: R8.1 20.19,19.81 21.08,18.92 21.08,16.38 23.62,13.84 32.89,13.84 35.31,11.43 50.42,11.43 51.56,12.57 65.53,12.57 65.88,12.92 U5.37
TX
  Top 0.305: U5.13 59.88,28.89 59.05,28.07 54.1,28.07 49.71,32.46 U3.6
TX_DEV  (via drill 0.51 pad 0.51)
  Top 0.305: v44.7,36.96 43.18,36.96 42.55,36.32 42.55,33.02 41.98,32.46 U3.15
  Bottom 0.61: SV4.8 44.7,43.43 v44.7,36.96

### Text on the board
Top: by | - | 3V | Fl | w | L0L | 2011 | APBTeam | - | - | 5V
usefull_info: Chargeur | i2c | BAT | Dev | Moteur | Laser | 5V | PWM1 | PWM2 | PWM3